# EAGLE schematic backplane_rev_2 (EAGLE 9.6.2)
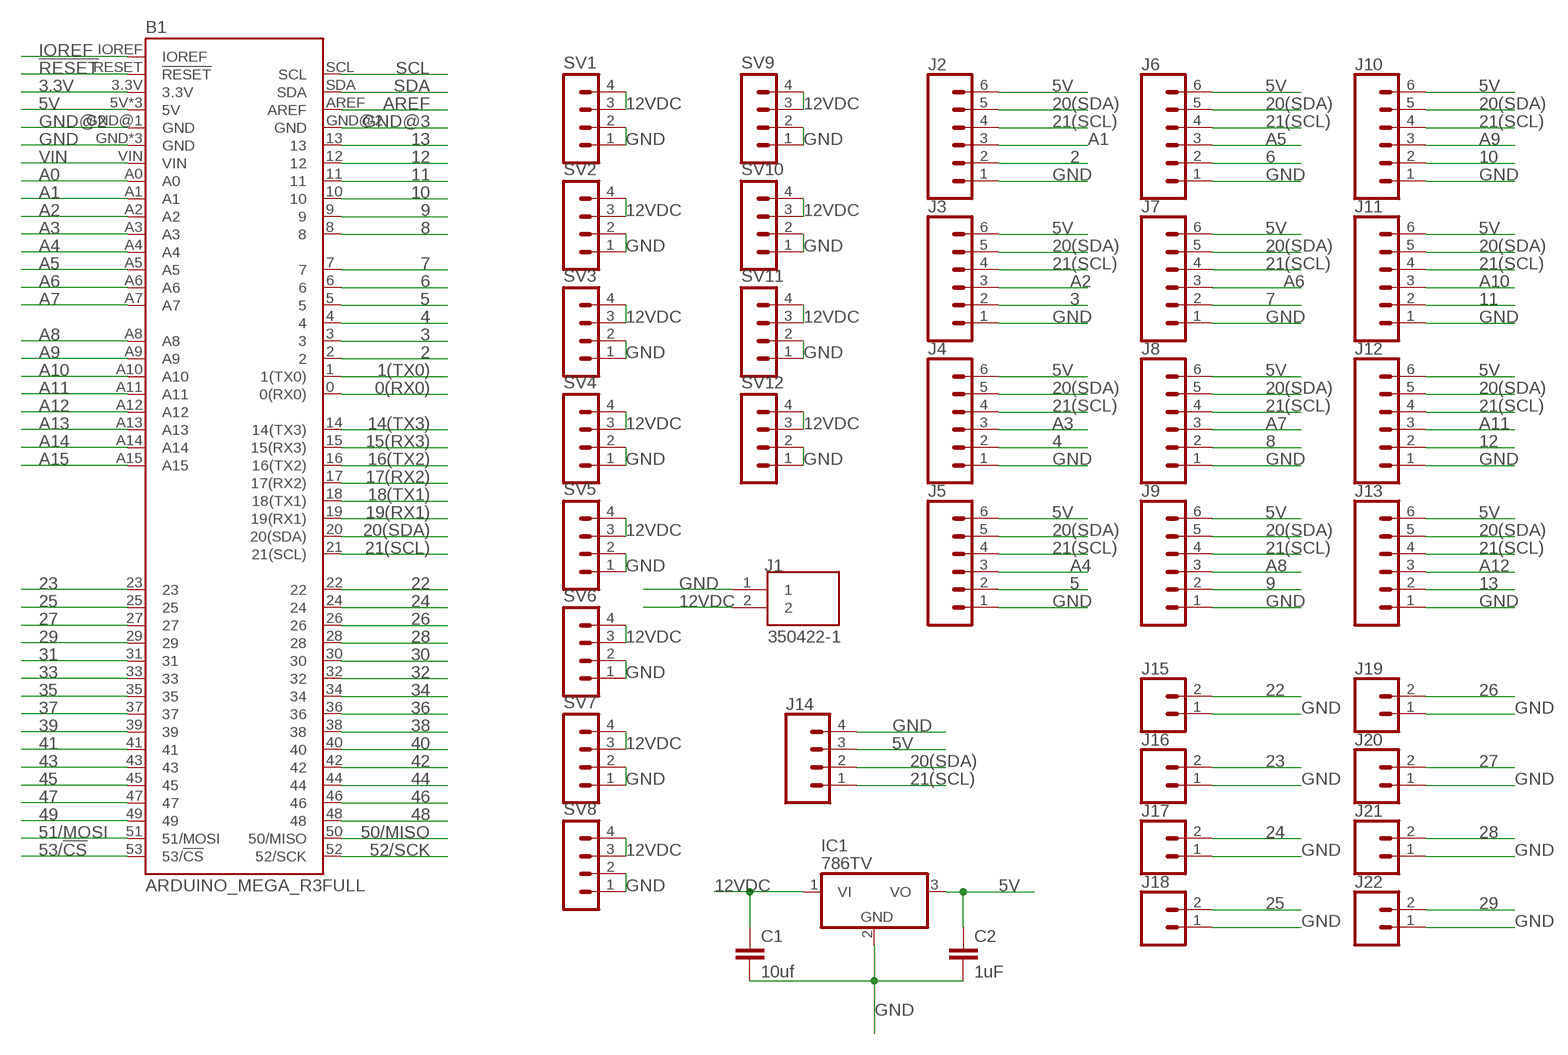
[diagram p0: schematic, sheet 1]

## Parts
B1  ARDUINO_MEGA_R3FULL  [ARDUINO_MEGA_NO_SILK]
C1  10uf  C2,5-3  [C2.5-3]
C2  1uF  C2,5-3  [C2.5-3]
IC1  786TV  [TO220V]
J1  350422-1  [POWER-PIN]
J2  CONN_06NO_SILK_FEMALE_PTH  [1X06_NO_SILK]
J3  CONN_06NO_SILK_FEMALE_PTH  [1X06_NO_SILK]
J4  CONN_06NO_SILK_FEMALE_PTH  [1X06_NO_SILK]
J5  CONN_06NO_SILK_FEMALE_PTH  [1X06_NO_SILK]
J6  CONN_06NO_SILK_FEMALE_PTH  [1X06_NO_SILK]
J7  CONN_06NO_SILK_FEMALE_PTH  [1X06_NO_SILK]
J8  CONN_06NO_SILK_FEMALE_PTH  [1X06_NO_SILK]
J9  CONN_06NO_SILK_FEMALE_PTH  [1X06_NO_SILK]
J10  CONN_06NO_SILK_FEMALE_PTH  [1X06_NO_SILK]
J11  CONN_06NO_SILK_FEMALE_PTH  [1X06_NO_SILK]
J12  CONN_06NO_SILK_FEMALE_PTH  [1X06_NO_SILK]
J13  CONN_06NO_SILK_FEMALE_PTH  [1X06_NO_SILK]
J14  CONN_04PTH  [1X04]
J15  CONN_02  [1X02]
J16  CONN_02  [1X02]
J17  CONN_02  [1X02]
J18  CONN_02  [1X02]
J19  CONN_02  [1X02]
J20  CONN_02  [1X02]
J21  CONN_02  [1X02]
J22  CONN_02  [1X02]
SV1  MA04-1  [MA04-1]
SV2  MA04-1  [MA04-1]
SV3  MA04-1  [MA04-1]
SV4  MA04-1  [MA04-1]
SV5  MA04-1  [MA04-1]
SV6  MA04-1  [MA04-1]
SV7  MA04-1  [MA04-1]
SV8  MA04-1  [MA04-1]
SV9  MA04-1  [MA04-1]
SV10  MA04-1  [MA04-1]
SV11  MA04-1  [MA04-1]
SV12  MA04-1  [MA04-1]

## Nets
0(RX0): B1.0(0(RX0))
1(TX0): B1.1(1(TX0))
2: B1.2 J2.2
3: B1.3 J3.2
3.3V: B1.3.3V
4: B1.4 J4.2
5: B1.5 J5.2
5V: B1.5V B1.5V@1(5V) B1.5V@2(5V) C2.1 IC1.3(VO) J2.6 J3.6 J4.6 J5.6 J6.6 J7.6 J8.6 J9.6 J10.6 J11.6 J12.6 J13.6 J14.3
6: B1.6 J6.2
7: B1.7 J7.2
8: B1.8 J8.2
9: B1.9 J9.2
10: B1.10 J10.2
11: B1.11 J11.2
12: B1.12 J12.2
12VDC: C1.1 IC1.1(VI) J1.2 SV1.3 SV1.4 SV2.3 SV2.4 SV3.3 SV3.4 SV4.3 SV4.4 SV5.3 SV5.4 SV6.3 SV6.4 SV7.3 SV7.4 SV8.3 SV8.4 SV9.3 SV9.4 SV10.3 SV10.4 SV11.3 SV11.4 SV12.3 SV12.4
13: B1.13 J13.2
14(TX3): B1.14(14(TX3))
15(RX3): B1.15(15(RX3))
16(TX2): B1.16(16(TX2))
17(RX2): B1.17(17(RX2))
18(TX1): B1.18(18(TX1))
19(RX1): B1.19(19(RX1))
20(SDA): B1.20(20(SDA)) J2.5 J3.5 J4.5 J5.5 J6.5 J7.5 J8.5 J9.5 J10.5 J11.5 J12.5 J13.5 J14.2
21(SCL): B1.21(21(SCL)) J2.4 J3.4 J4.4 J5.4 J6.4 J7.4 J8.4 J9.4 J10.4 J11.4 J12.4 J13.4 J14.1
22: B1.22 J15.2
23: B1.23 J16.2
24: B1.24 J17.2
25: B1.25 J18.2
26: B1.26 J19.2
27: B1.27 J20.2
28: B1.28 J21.2
29: B1.29 J22.2
30: B1.30
31: B1.31
32: B1.32
33: B1.33
34: B1.34
35: B1.35
36: B1.36
37: B1.37
38: B1.38
39: B1.39
40: B1.40
41: B1.41
42: B1.42
43: B1.43
44: B1.44
45: B1.45
46: B1.46
47: B1.47
48: B1.48
49: B1.49
50/MISO: B1.50(50/MISO)
51/MOSI: B1.51(51/MOSI)
52/SCK: B1.52(52/SCK)
53/!CS: B1.53(53/!CS)
!RESET: B1.RESET(!RESET)
A0: B1.A0
A1: B1.A1 J2.3
A2: B1.A2 J3.3
A3: B1.A3 J4.3
A4: B1.A4 J5.3
A5: B1.A5 J6.3
A6: B1.A6 J7.3
A7: B1.A7 J8.3
A8: B1.A8 J9.3
A9: B1.A9 J10.3
A10: B1.A10 J11.3
A11: B1.A11 J12.3
A12: B1.A12 J13.3
A13: B1.A13
A14: B1.A14
A15: B1.A15
AREF: B1.AREF
GND: B1.GND B1.GND@3(GND) B1.GND@4(GND) C1.2 C2.2 IC1.2(GND) J1.1 J2.1 J3.1 J4.1 J5.1 J6.1 J7.1 J8.1 J9.1 J10.1 J11.1 J12.1 J13.1 J14.4 J15.1 J16.1 J17.1 J18.1 J19.1 J20.1 J21.1 J22.1 SV1.1 SV1.2 SV2.1 SV2.2 SV3.1 SV3.2 SV4.1 SV4.2 SV5.1 SV5.2 SV6.1 SV6.2 SV7.1 SV7.2 SV8.1 SV8.2 SV9.1 SV9.2 SV10.1 SV10.2 SV11.1 SV11.2 SV12.1 SV12.2
GND@2: B1.GND@1(GND)
GND@3: B1.GND@2(GND)
IOREF: B1.IOREF
SCL: B1.SCL
SDA: B1.SDA
VIN: B1.VIN

## Library data of the parts
B1 = SparkFun-Boards:ARDUINO_MEGA_R3: Arduino Mega R3 ATmega2560 R3 compatible footprint. SparkFun Products: Arduino Mega 2560 R3 <https://www.sparkfun.com/products/11061>
C1 C2 = capacitor-wima:C: CAPACITOR naming: grid - package width
IC1 = linear:78*: Positive VOLTAGE REGULATOR Source: http://cache.national.com/ds/LM/LM78L05.pdf http://www.fairchildsemi.com/ds/LM/LM7805.pdf
J1 = 350422-1:350422-1; COMMENT: 350422-1; DESCRIPTION: 02P CMNL HDR ASSY PC NATL; DIGI-KEY_PART_NUMBER: A14367-ND; EU_ROHS_COMPLIANCE: Compliant; MF: TE Connectivity; MP: 350422-1; PACKAGE: None; PURCHASE-URL: https://pricing.snapeda.com/search/part/350422-1/?ref=eda
J2-J13 = SparkFun-Connectors:CONN_06: Multi connection point. Often used as Generic Header-pin footprint for 0.1 inch spaced/style header connections On any of the 0.1 inch spaced packages, you can populate with these: Break Away Headers - Straight <https://www.sparkfun.com/products/116> (PRT-00116) Break Away Male Headers - Right Angle <https://www.sparkfun.com/products/553> (PRT-00553) Female Headers <https://www.sparkfun.com/products/115> (PRT-00115) Break Away Headers - Machine Pin <https://www.sparkfun.com/products/117> (PRT-00117) Break Away Female Headers - Swiss Machine Pin <https://www.sparkfun.com/products/743> (PRT-00743) Arduino Stackable Header - 6 Pin <https://www.sparkfun.com/products/9280> (PRT-09280) For SCREWTERMINALS and SPRING TERMINALS visit here: Screw Terimnals on SparkFun.com <https://www.sparkfun.com/search/results?term=Screw+Terminals> (5mm/3.5mm/2.54mm spacing) This device is also useful as a general connection point to wire up your design to another part of your project. Our various solder wires solder well into these plated through hole pads. Hook-Up Wire - Assortment (Stranded, 22 AWG) <https://www.sparkfun.com/products/11375> (PRT-11375) Hook-Up Wire - Assortment (Solid Core, 22 AWG) <https://www.sparkfun.com/products/11367> (PRT-11367) View the entire wire category on our website here <https://www.sparkfun.com/categories/141>; PROD_ID: CONN-08437
J14 = SparkFun-Connectors:CONN_04: Multi connection point. Often used as Generic Header-pin footprint for 0.1 inch spaced/style header connections On any of the 0.1 inch spaced packages, you can populate with these: Break Away Headers - Straight <https://www.sparkfun.com/products/116> (PRT-00116) Break Away Male Headers - Right Angle <https://www.sparkfun.com/products/553> (PRT-00553) Female Headers <https://www.sparkfun.com/products/115> (PRT-00115) Break Away Headers - Machine Pin <https://www.sparkfun.com/products/117> (PRT-00117) Break Away Female Headers - Swiss Machine Pin <https://www.sparkfun.com/products/743> (PRT-00743) For SCREWTERMINALS and SPRING TERMINALS visit here: Screw Terimnals on SparkFun.com <https://www.sparkfun.com/search/results?term=Screw+Terminals> (5mm/3.5mm/2.54mm spacing) This device is also useful as a general connection point to wire up your design to another part of your project. Our various solder wires solder well into these plated through hole pads. Hook-Up Wire - Assortment (Stranded, 22 AWG) <https://www.sparkfun.com/products/11375> (PRT-11375) Hook-Up Wire - Assortment (Solid Core, 22 AWG) <https://www.sparkfun.com/products/11367> (PRT-11367) View the entire wire category on our website here <https://www.sparkfun.com/categories/141> Special notes: Molex polarized connector foot print use with SKU : PRT-08231 with associated crimp pins and housings. 1MM SMD Version SKU: PRT-10208; PROD_ID: CONN-09696
J15-J22 = SparkFun-Connectors:CONN_02: Multi connection point. Often used as Generic Header-pin footprint for 0.1 inch spaced/style header connections On any of the 0.1 inch spaced packages, you can populate with these: Break Away Headers - Straight <https://www.sparkfun.com/products/116> (PRT-00116) Break Away Male Headers - Right Angle <https://www.sparkfun.com/products/553> (PRT-00553) Female Headers <https://www.sparkfun.com/products/115> (PRT-00115) Break Away Headers - Machine Pin <https://www.sparkfun.com/products/117> (PRT-00117) Break Away Female Headers - Swiss Machine Pin <https://www.sparkfun.com/products/743> (PRT-00743) For SCREWTERMINALS and SPRING TERMINALS visit here: Screw Terimnals on SparkFun.com <https://www.sparkfun.com/search/results?term=Screw+Terminals> (5mm/3.5mm/2.54mm spacing) This device is also useful as a general connection point to wire up your design to another part of your project. Our various solder wires solder well into these plated through hole pads. Hook-Up Wire - Assortment (Stranded, 22 AWG) <https://www.sparkfun.com/products/11375> (PRT-11375) Hook-Up Wire - Assortment (Solid Core, 22 AWG) <https://www.sparkfun.com/products/11367> (PRT-11367) View the entire wire category on our website here <https://www.sparkfun.com/categories/141> Special notes: Molex polarized connector foot print use with: PRT-08233 with associated crimp pins and housings. 2.54_SCREWTERM for use with PRT-10571. 3.5mm Screw Terminal footprints for PRT-08084 5mm Screw Terminal footprints for use with PRT-08432
SV1-SV12 = con-lstb:MA04-1: PIN HEADER; OC_FARNELL: unknown; OC_NEWARK: unknown